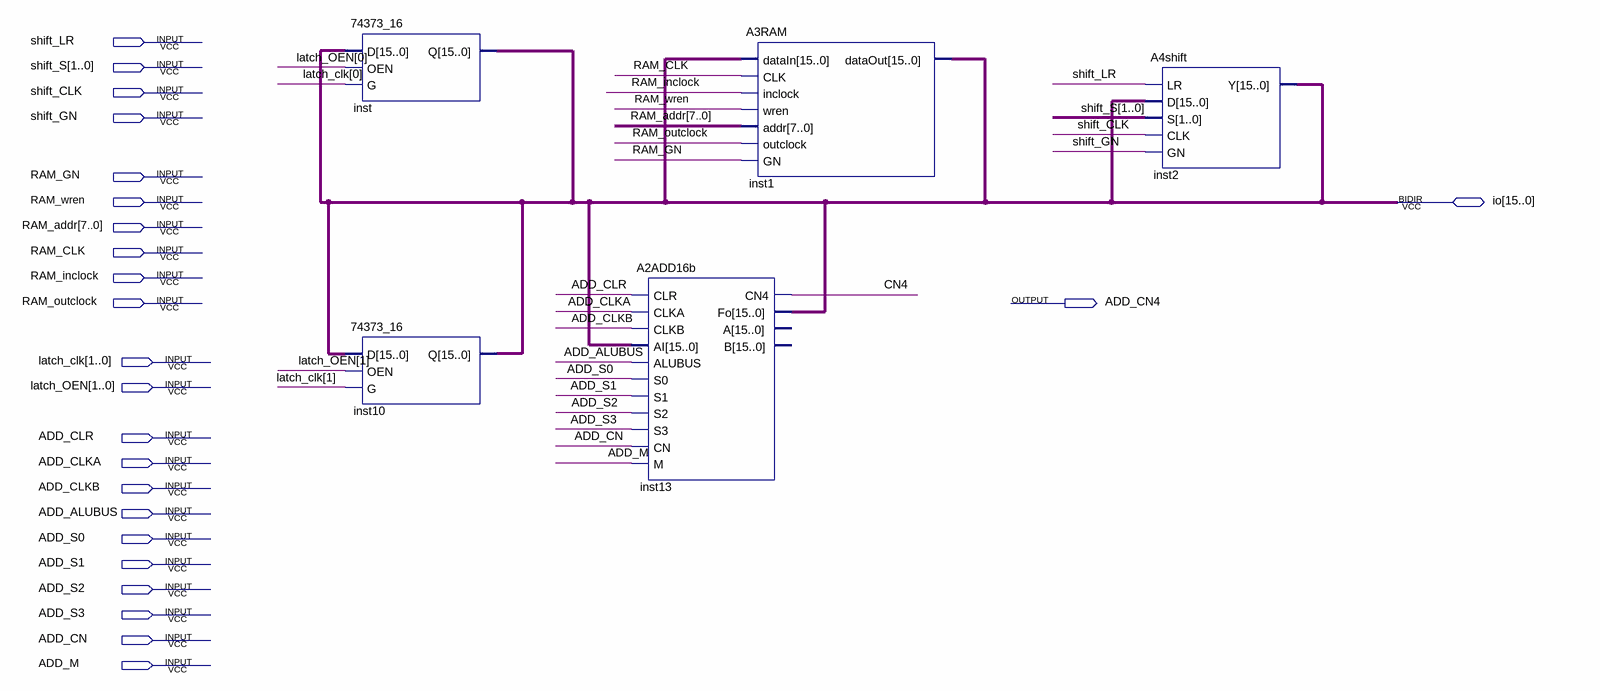
[diagram p0: schematic sheet]
// Quartus schematic A4.bdf as structural Verilog: 5 symbols, 24 pins
module A4 (
  input  shift_LR,
  input  [1:0] shift_S,
  input  shift_CLK,
  input  shift_GN,
  input  RAM_GN,
  input  RAM_wren,
  input  [7:0] RAM_addr,
  input  RAM_CLK,
  input  RAM_inclock,
  input  RAM_outclock,
  input  [1:0] latch_clk,
  input  [1:0] latch_OEN,
  input  ADD_CLR,
  input  ADD_CLKA,
  input  ADD_CLKB,
  input  ADD_ALUBUS,
  input  ADD_S0,
  input  ADD_S1,
  input  ADD_S2,
  input  ADD_S3,
  input  ADD_CN,
  input  ADD_M,
  inout  [15:0] io,
  output ADD_CN4
);

  wire CN4;

  \74373_16  inst (.D(io), .OEN(latch_OEN[0]), .G(latch_clk[0]), .Q(io));
  \74373_16  inst10 (.D(io), .OEN(latch_OEN[1]), .G(latch_clk[1]), .Q(io));
  A2ADD16b inst13 (
    .CLR(ADD_CLR), .CLKA(ADD_CLKA), .CLKB(ADD_CLKB), .AI(io), .ALUBUS(ADD_ALUBUS), .S0(ADD_S0), .S1(ADD_S1),
    .S2(ADD_S2), .S3(ADD_S3), .CN(ADD_CN), .M(ADD_M), .CN4(CN4), .Fo(io));  // open: A, B
  A3RAM inst1 (
    .dataIn(io), .CLK(RAM_CLK), .inclock(RAM_inclock), .wren(RAM_wren), .addr(RAM_addr),
    .outclock(RAM_outclock), .GN(RAM_GN), .dataOut(io));
  A4shift inst2 (.LR(shift_LR), .D(io), .S(shift_S), .CLK(shift_CLK), .GN(shift_GN), .Y(io));
endmodule
